# EAGLE design Tiles_Proto3_RevB (EAGLE 8.4.1)
CNAME: TIles Prototype 3; CREVISION: B; DESIGNER: Simone Mora
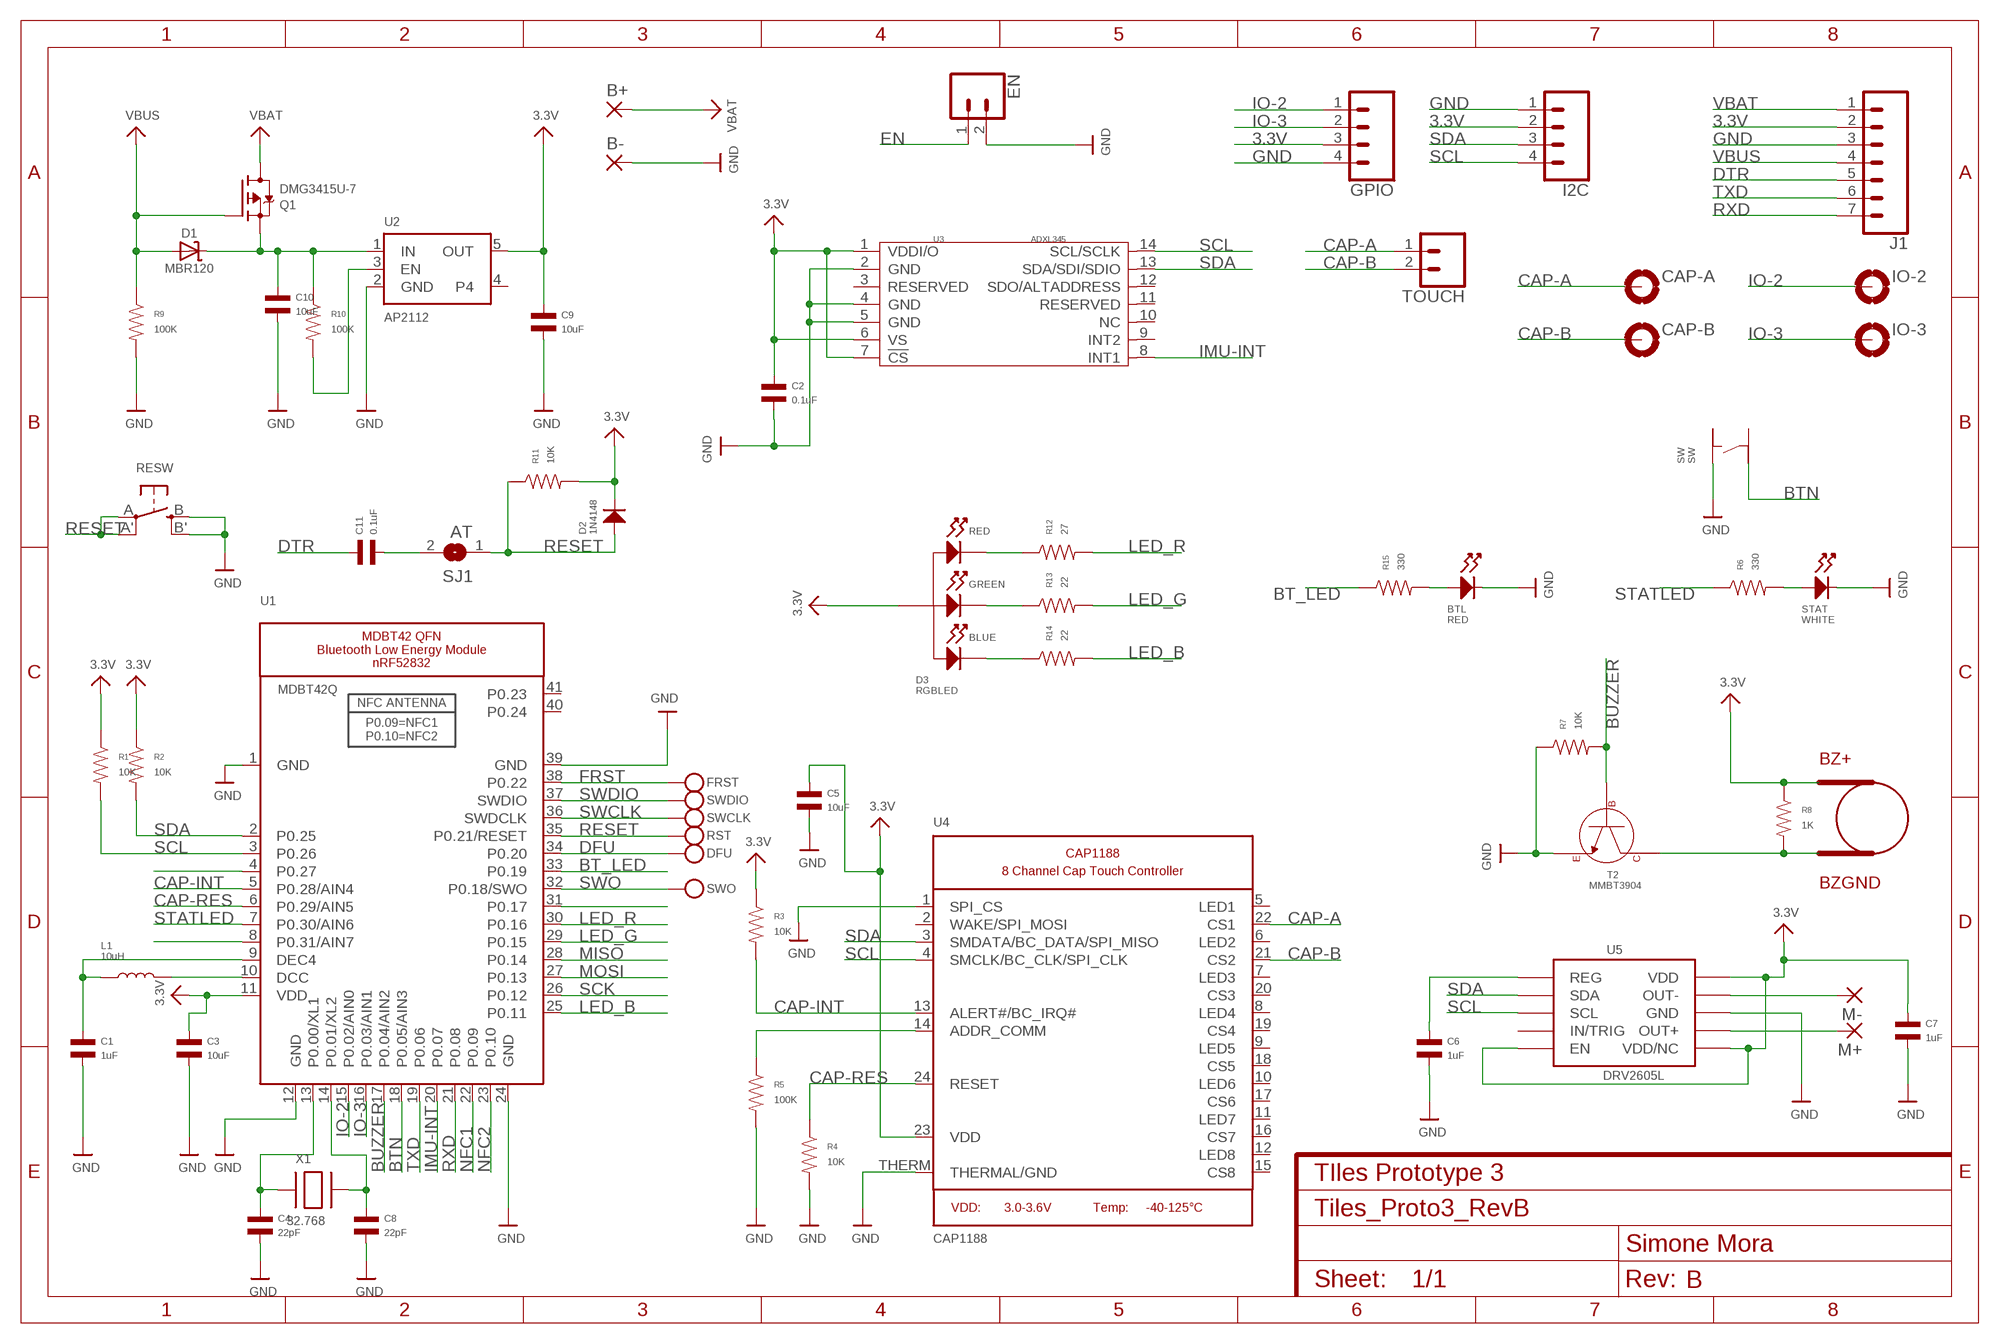
[diagram p0: schematic, sheet 1]

## Parts
B+  SMD2  [SMD1,27-2,54]
B-  SMD2  [SMD1,27-2,54]
BTL  RED  LED_SINGLE-0603-RED  [LED0603]
BUZZER  4MBUZ  [BUZPKG]
C1  1uF  CAPACITOR_NP_0603  [C0603]
C2  0.1uF  CAPACITOR_NP_0603  [C0603]
C3  10uF  CAPACITOR_NP_1206  [C1206]
C4  22pF  CAPACITOR_NP_0603  [C0603]
C5  10uF  CAPACITOR_NP_1206  [C1206]
C6  1uF  CAPACITOR_NP_0603  [C0603]
C7  1uF  CAPACITOR_NP_0603  [C0603]
C8  22pF  CAPACITOR_NP_0603  [C0603]
C9  10uF  CAPACITOR_NP_1206  [C1206]
C10  10uF  CAPACITOR_NP_1206  [C1206]
C11  0.1uF  CAPACITOR_NP_0603  [C0603]
CAP-A  MOUNT-PAD-ROUND2.5  [2,5-PAD-SIM]
CAP-B  MOUNT-PAD-ROUND2.5  [2,5-PAD-SIM]
D1  MBR120  DIODE-SCHOTTKYSOD-123  [SOD-123]
D2  1N4148  DIODES_1N4148_SOD-123  [SOD-123]
D3  RGBLED  LED_RGB_CA_PLCC4  [PLCC4]
DFU  TESTPOINTROUND2MM  [TESTPOINT_ROUND_2MM]
EN  CONN_021X02_NO_SILK  [1X02_NO_SILK]
FRST  TESTPOINT1.5X2.0MM_NOCREAM  [PAD-1.5X2.0]
GPIO  CONN_041X04_NO_SILK  [1X04_NO_SILK]
I2C  CONN_04_SIM1X04_NO_SILK  [1X04_NO_SILK_LNG]
IO-2  MOUNT-PAD-ROUND2.5  [2,5-PAD-SIM]
IO-3  MOUNT-PAD-ROUND2.5  [2,5-PAD-SIM]
J1  CONN_07  [1X07]
L1  10uH  INDUCTOR_1210  [L1210]
M+  1,6/0,8  [1,6/0,8]
M-  1,6/0,8  [1,6/0,8]
Q1  DMG3415U-7  MOSFET-P  [SOT23-R]
R1  10K  RESISTOR_0603  [R0603]
R2  10K  RESISTOR_0603  [R0603]
R3  10K  RESISTOR_0603  [R0603]
R4  10K  RESISTOR_0603  [R0603]
R5  100K  RESISTOR_0603  [R0603]
R6  330  RESISTOR_0603  [R0603]
R7  10K  RESISTOR_0603  [R0603]
R8  1K  RESISTOR_0603  [R0603]
R9  100K  RESISTOR_0603  [R0603]
R10  100K  RESISTOR_0603  [R0603]
R11  10K  RESISTOR_0603  [R0603]
R12  27  RESISTOR_0603  [R0603]
R13  22  RESISTOR_0603  [R0603]
R14  22  RESISTOR_0603  [R0603]
R15  330  RESISTOR_0603  [R0603]
RESW  SWITCH_TACT_SMT4.6X2.8  [BTN_KMR2_4.6X2.8]
RST  TESTPOINTROUND2MM  [TESTPOINT_ROUND_2MM]
SJ1  AT  SOLDERJUMPERCLOSED  [SOLDERJUMPER_CLOSEDWIRE]
STAT  WHITE  LED_SINGLE-0603-RED  [LED0603]
SW  SW  TACT_4.2MM  [TACT4.2MM]
SWCLK  TESTPOINTROUND2MM  [TESTPOINT_ROUND_2MM]
SWDIO  TESTPOINTROUND2MM  [TESTPOINT_ROUND_2MM]
SWO  TESTPOINTROUND2MM  [TESTPOINT_ROUND_2MM]
T2  MMBT3904  NPN_BJTMMBT3904_SOT-23-3  [SOT-23-3]
TOUCH  CONN_021X02_NO_SILK  [1X02_NO_SILK]
U1  MDBT42Q  NRF52832_MODULE_MDBT42  [BLE_MODULE_RAYTAC_MDBT42]
U2  AP2112  VREG_SOT23-5  [SOT23-5]
U3  ADXL345  MOTION/POSITION-ADXL345BCCZ-RL(14P-5.0X3.0MM)  [LGA14-0.8-5.0X3.0MM]
U4  CAP1188  [QFN24_4MM_SMSC]
U5  DRV2605L  [VSSOP-10]
X1  32.768  XTAL-3.2X1.5  [XTAL3215]

## Nets
3.3V: BUZZER.BZ+(BUZSIG+) C2.P$1 C3.P$1 C5.P$1 C7.P$1 C9.P$1 D2.CATHODE D3.P$1(ANODE) GPIO.3 I2C.2 J1.2 R1.P$1 R2.P$1 R3.P$1 R8.P$1 R11.P$2 U1.11(VDD) U2.5(OUT) U3.1(VDDI/O) U3.6(VS) U3.7(!CS) U4.23(VDD) U5.P$5(EN) U5.P$6(VDD/NC) U5.P$10(VDD)
BT_LED: R15.P$1 U1.33(P0.19)
BTN: SW.P$3 U1.18(P0.05/AIN3)
BUZZER: R7.P$2 T2.P$1(BASE) U1.17(P0.04/AIN2)
CAP-A: CAP-A.B2,8(MOUNT) TOUCH.1 U4.22(CS1)
CAP-B: CAP-B.B2,8(MOUNT) TOUCH.2 U4.21(CS2)
CAP-INT: R3.P$2 U1.5(P0.28/AIN4) U4.13(ALERT#/BC_IRQ#)
CAP-RES: R4.P$1 U1.6(P0.29/AIN5) U4.24(RESET)
DFU: DFU.P$1 U1.34(P0.20)
DTR: C11.P$1 J1.5
EN: EN.1 R10.P$2 U2.3(EN)
FRST: FRST.P$1 U1.38(P0.22)
GND: B-.1(P) BTL.CATHODE C1.P$2 C2.P$2 C3.P$2 C4.P$2 C5.P$2 C6.P$2 C7.P$2 C8.P$2 C9.P$2 C10.P$2 EN.2 GPIO.4 I2C.1 J1.3 R4.P$2 R5.P$2 R7.P$1 R9.P$2 RESW.B'(S1) RESW.B(S) STAT.CATHODE SW.P$1 T2.P$2(EMITTER) U1.1(GND) U1.12(GND) U1.24(GND) U1.39(GND) U2.2(GND) U3.2(GND) U3.4(GND) U3.5(GND) U4.1(SPI_CS) U4.THERM(THERMAL/GND) U5.P$8(GND)
IMU-INT: U1.20(P0.07) U3.8(INT1)
IO-2: GPIO.1 IO-2.B2,8(MOUNT) U1.15(P0.02/AIN0)
IO-3: GPIO.2 IO-3.B2,8(MOUNT) U1.16(P0.03/AIN1)
LED_B: R14.P$2 U1.25(P0.11)
LED_G: R13.P$2 U1.29(P0.15)
LED_R: R12.P$2 U1.30(P0.16)
MISO: U1.28(P0.14)
MOSI: U1.27(P0.13)
N$1: L1.P$2 U1.10(DCC)
N$2: C1.P$1 L1.P$1 U1.9(DEC4)
N$3: R5.P$1 U4.14(ADDR_COMM)
N$4: BUZZER.BZ-(BUZGND) R8.P$2 T2.P$3(COLLECTOR)
N$5: C6.P$1 U5.P$1(REG)
N$7: M-.1(P) U5.P$9(OUT-)
N$8: M+.1(P) U5.P$7(OUT+)
N$9: R6.P$2 STAT.ANODE
N$11: C4.P$1 U1.13(P0.00/XL1) X1.P$1
N$12: C8.P$1 U1.14(P0.01/XL2) X1.P$2
N$13: C10.P$1 D1.C Q1.2(S) R10.P$1 U2.1(IN)
N$14: D3.P$2(CATHODE_RED) R12.P$1
N$15: U1.4(P0.27)
N$16: D3.P$3(CATHODE_GREEN) R13.P$1
N$17: D3.P$4(CATHODE_BLUE) R14.P$1
N$18: BTL.ANODE R15.P$2
N$19: U1.8(P0.31/AIN7)
N$20: C11.P$2 SJ1.2
N$26: U1.31(P0.17)
NFC1: U1.22(P0.09)
NFC2: U1.23(P0.10)
RESET: D2.ANODE R11.P$1 RESW.A'(P1) RESW.A(P) RST.P$1 SJ1.1 U1.35(P0.21/RESET)
RXD: J1.7 U1.21(P0.08)
SCK: U1.26(P0.12)
SCL: I2C.4 R1.P$2 U1.3(P0.26) U3.14(SCL/SCLK) U4.4(SMCLK/BC_CLK/SPI_CLK) U5.P$2(SCL)
SDA: I2C.3 R2.P$2 U1.2(P0.25) U3.13(SDA/SDI/SDIO) U4.3(SMDATA/BC_DATA/SPI_MISO) U5.P$3(SDA)
STATLED: R6.P$1 U1.7(P0.30/AIN6)
SWCLK: SWCLK.P$1 U1.36(SWDCLK)
SWDIO: SWDIO.P$1 U1.37(SWDIO)
SWO: SWO.P$1 U1.32(P0.18/SWO)
TXD: J1.6 U1.19(P0.06)
VBAT: B+.1(P) J1.1 Q1.3(D)
VBUS: D1.A J1.4 Q1.1(G) R9.P$1
Unconnected: SW.P$2 SW.P$4 U1.40(P0.24) U1.41(P0.23) U2.4 U3.3(RESERVED) U3.9(INT2) U3.10(NC) U3.11(RESERVED) U3.12(SDO/ALTADDRESS) U4.2(WAKE/SPI_MOSI) U4.5(LED1) U4.6(LED2) U4.7(LED3) U4.8(LED4) U4.9(LED5) U4.10(LED6) U4.11(LED7) U4.12(LED8) U4.15(CS8) U4.16(CS7) U4.17(CS6) U4.18(CS5) U4.19(CS4) U4.20(CS3) U5.P$4(IN/TRIG)

## Library data of the parts
B+ B- = wirepad:SMD2: SMD PAD
BTL = MF_LEDs:LED_SINGLE: Library: MF_LEDs Description: Device for Single LED Packages. Manufacture part number (MFG#) can be added via Attributes.; HOUSEPART: YES; MPN: MF-LED-0603-RED; POPULATE: 1; URL: https://factory.macrofab.com/part/MF-LED-0603-RED; VALUE: MF-LED-0603-RED
BUZZER = tiles:4MBUZ; HOUSEPART: no; MPN: 490-CMT-4023S-SMT-TR; POPULATE: 1
C1 C6 C7 = MF_Passives:CAPACITOR_NP: Library: MF_Passives Description: Device for Non-Polarized Capacitors. Manufacture part number (MPN) can be added via Attributes. Check https://factory.macrofab.com/parts for the house parts list.; HOUSEPART: YES; MPN: MF-CAP-0603-1uF; POPULATE: 1
C2 C11 = MF_Passives:CAPACITOR_NP: Library: MF_Passives Description: Device for Non-Polarized Capacitors. Manufacture part number (MPN) can be added via Attributes. Check https://factory.macrofab.com/parts for the house parts list.; HOUSEPART: YES; MPN: MF-CAP-0603-0.1uF; POPULATE: 1
C3 C5 C9 C10 = MF_Passives:CAPACITOR_NP: Library: MF_Passives Description: Device for Non-Polarized Capacitors. Manufacture part number (MPN) can be added via Attributes. Check https://factory.macrofab.com/parts for the house parts list.; HOUSEPART: YES; MPN: MF-CAP-1206-10uF; POPULATE: 1
C4 C8 = MF_Passives:CAPACITOR_NP: Library: MF_Passives Description: Device for Non-Polarized Capacitors. Manufacture part number (MPN) can be added via Attributes. Check https://factory.macrofab.com/parts for the house parts list.; HOUSEPART: YES; MPN: MF-CAP-0603-22pF; POPULATE: 1
CAP-A CAP-B IO-2 IO-3 = tiles:MOUNT-PAD-ROUND: MOUNTING PAD, round; POPULATE: 0
D1 = microbuilder2:DIODE-SCHOTTKY; HOUSEPART: NO; MPN: MBR120LSFT1G; POPULATE: 1
D2 = MF_Discrete_Semiconductor:DIODES: Library: MF_Discrete_Semiconductor Description: Device for Single Packaged Diodes.; HOUSEPART: YES; MPN: MF-DIO-SOD123-1N4148; POPULATE: 1; URL: https://factory.macrofab.com/part/MF-DIO-SOD123-1N4148; VALUE: MF-DIO-SOD123-1N4148
D3 = MF_LEDs:LED_RGB_CA: Library: MF_LEDs Description: Device for RGB LED Packages with Common Anodes. Manufacture part number (MFG#) can be added via Attributes.; HOUSEPART: YES; MPN: MF-LED-3228-RGB; POPULATE: 1; URL: https://factory.macrofab.com/part/MF-LED-3228-RGB; VALUE: MF-LED-3228-RGB
DFU FRST RST SWCLK SWDIO SWO = microbuilder2:TESTPOINT: Test Point Various test points for characterisation and PCB testing TESTPOINT_SMT - Compact Surface Mount Test Point [Digikey: 5016KTR-ND]; POPULATE: 0
EN TOUCH = SparkFun-Connectors:CONN_02: Multi connection point. Often used as Generic Header-pin footprint for 0.1 inch spaced/style header connections On any of the 0.1 inch spaced packages, you can populate with these: Break Away Headers - Straight <https://www.sparkfun.com/products/116> (PRT-00116) Break Away Male Headers - Right Angle <https://www.sparkfun.com/products/553> (PRT-00553) Female Headers <https://www.sparkfun.com/products/115> (PRT-00115) Break Away Headers - Machine Pin <https://www.sparkfun.com/products/117> (PRT-00117) Break Away Female Headers - Swiss Machine Pin <https://www.sparkfun.com/products/743> (PRT-00743) For SCREWTERMINALS and SPRING TERMINALS visit here: Screw Terimnals on SparkFun.com <https://www.sparkfun.com/search/results?term=Screw+Terminals> (5mm/3.5mm/2.54mm spacing) This device is also useful as a general connection point to wire up your design to another part of your project. Our various solder wires solder well into these plated through hole pads. Hook-Up Wire - Assortment (Stranded, 22 AWG) <https://www.sparkfun.com/products/11375> (PRT-11375) Hook-Up Wire - Assortment (Solid Core, 22 AWG) <https://www.sparkfun.com/products/11367> (PRT-11367) View the entire wire category on our website here <https://www.sparkfun.com/categories/141> Special notes: Molex polarized connector foot print use with: PRT-08233 with associated crimp pins and housings. 2.54_SCREWTERM for use with PRT-10571. 3.5mm Screw Terminal footprints for PRT-08084 5mm Screw Terminal footprints for use with PRT-08432; POPULATE: 0
GPIO = SparkFun-Connectors:CONN_04: Multi connection point. Often used as Generic Header-pin footprint for 0.1 inch spaced/style header connections On any of the 0.1 inch spaced packages, you can populate with these: Break Away Headers - Straight <https://www.sparkfun.com/products/116> (PRT-00116) Break Away Male Headers - Right Angle <https://www.sparkfun.com/products/553> (PRT-00553) Female Headers <https://www.sparkfun.com/products/115> (PRT-00115) Break Away Headers - Machine Pin <https://www.sparkfun.com/products/117> (PRT-00117) Break Away Female Headers - Swiss Machine Pin <https://www.sparkfun.com/products/743> (PRT-00743) For SCREWTERMINALS and SPRING TERMINALS visit here: Screw Terimnals on SparkFun.com <https://www.sparkfun.com/search/results?term=Screw+Terminals> (5mm/3.5mm/2.54mm spacing) This device is also useful as a general connection point to wire up your design to another part of your project. Our various solder wires solder well into these plated through hole pads. Hook-Up Wire - Assortment (Stranded, 22 AWG) <https://www.sparkfun.com/products/11375> (PRT-11375) Hook-Up Wire - Assortment (Solid Core, 22 AWG) <https://www.sparkfun.com/products/11367> (PRT-11367) View the entire wire category on our website here <https://www.sparkfun.com/categories/141> Special notes: Molex polarized connector foot print use with SKU : PRT-08231 with associated crimp pins and housings. 1MM SMD Version SKU: PRT-10208; POPULATE: 0; PROD_ID: CONN-09696
I2C = tiles:CONN_04_SIM: Multi connection point. Often used as Generic Header-pin footprint for 0.1 inch spaced/style header connections On any of the 0.1 inch spaced packages, you can populate with these: Break Away Headers - Straight <https://www.sparkfun.com/products/116> (PRT-00116) Break Away Male Headers - Right Angle <https://www.sparkfun.com/products/553> (PRT-00553) Female Headers <https://www.sparkfun.com/products/115> (PRT-00115) Break Away Headers - Machine Pin <https://www.sparkfun.com/products/117> (PRT-00117) Break Away Female Headers - Swiss Machine Pin <https://www.sparkfun.com/products/743> (PRT-00743) For SCREWTERMINALS and SPRING TERMINALS visit here: Screw Terimnals on SparkFun.com <https://www.sparkfun.com/search/results?term=Screw+Terminals> (5mm/3.5mm/2.54mm spacing) This device is also useful as a general connection point to wire up your design to another part of your project. Our various solder wires solder well into these plated through hole pads. Hook-Up Wire - Assortment (Stranded, 22 AWG) <https://www.sparkfun.com/products/11375> (PRT-11375) Hook-Up Wire - Assortment (Solid Core, 22 AWG) <https://www.sparkfun.com/products/11367> (PRT-11367) View the entire wire category on our website here <https://www.sparkfun.com/categories/141> Special notes: Molex polarized connector foot print use with SKU : PRT-08231 with associated crimp pins and housings. 1MM SMD Version SKU: PRT-10208; POPULATE: 0; PROD_ID: CONN-09696
J1 = SparkFun-Connectors:CONN_07: Multi connection point. Often used as Generic Header-pin footprint for 0.1 inch spaced/style header connections On any of the 0.1 inch spaced packages, you can populate with these: Break Away Headers - Straight <https://www.sparkfun.com/products/116> (PRT-00116) Break Away Male Headers - Right Angle <https://www.sparkfun.com/products/553> (PRT-00553) Female Headers <https://www.sparkfun.com/products/115> (PRT-00115) Break Away Headers - Machine Pin <https://www.sparkfun.com/products/117> (PRT-00117) Break Away Female Headers - Swiss Machine Pin <https://www.sparkfun.com/products/743> (PRT-00743) For SCREWTERMINALS and SPRING TERMINALS visit here: Screw Terimnals on SparkFun.com <https://www.sparkfun.com/search/results?term=Screw+Terminals> (5mm/3.5mm/2.54mm spacing) This device is also useful as a general connection point to wire up your design to another part of your project. Our various solder wires solder well into these plated through hole pads. Hook-Up Wire - Assortment (Stranded, 22 AWG) <https://www.sparkfun.com/products/11375> (PRT-11375) Hook-Up Wire - Assortment (Solid Core, 22 AWG) <https://www.sparkfun.com/products/11367> (PRT-11367) View the entire wire category on our website here <https://www.sparkfun.com/categories/141> Special notes: Molex polarized connector foot print use with SKU : PRT-08231 with associated crimp pins and housings. 1MM SMD Version SKU: PRT-10208 NOTES ON THE VARIANTS LOCK and LOCK_LONGPADS... This footprint was designed to help hold the alignment of a through-hole component (i.e. 6-pin header) while soldering it into place. You may notice that each hole has been shifted either up or down by 0.005 of an inch from it's more standard position (which is a perfectly straight line). This slight alteration caused the pins (the squares in the middle) to touch the edges of the holes. Because they are alternating, it causes a "brace" to hold the component in place. 0.005 has proven to be the perfect amount of "off-center" position when using our standard breakaway headers. Although looks a little odd when you look at the bare footprint, once you have a header in there, the alteration is very hard to notice. Also,if you push a header all the way into place, it is covered up entirely on the bottom side.
L1 = MF_Passives:INDUCTOR: Library: MF_Passives Description: Device for Inductors. Manufacture part number (MPN) can be added via Attributes. Check https://factory.macrofab.com/parts for the house parts list.; HOUSEPART: YES; MPN: MF-IND-1210-10uH; POPULATE: 1
M+ M- = wirepad:1,6/0,8: THROUGH-HOLE PAD
Q1 = microbuilder2:MOSFET-P: P-Channel Mosfet LEGEND VDS: Voltage Drain-Source ID: Drain Current RDS(ON): Drain-Source On-State Resistance VGS(TH): Gate-Source Threshold Voltage CISS: Drain-Source Input Capacitance SOT-23 Name VDS ID RDS(ON) VGS(TH) CISS Order Number IRLML5103 30V 760mA 600 mOhm -- 75pF @ 25V Digikey: IRLML5103PBFCT-ND IRLML6401 12V 4.3A 50 mOhm 950mV @ 250µA 830pF @ 10V Digikey: IRLML6401PBFTR-ND NTR0202PL 20V 400mA 800 mOhm 2.3V @ 250uA 70pF @ 5V Digikey: NTR0202PLT1GOSTR-ND NTR4101PT1G 20V 1.8A 85 mOhm 1.2V @ 250uA 675pF @ 10V Digikey: NTR4101PT1GOSCT-ND DMP2004K 20V 600mA 900 mOhm 1V @ 250uA 175pF @ 16V Digikey: DMP2004KDICT-ND PMV65XP 20V 3.9A 76 mOhm 950mV @ 1mA 725pF @ 20V Digikey: 568-2358-2-ND TO-252 Name VDS ID RDS(ON) VGS(TH) CISS Order Number AOD417 30V 25A 34 mOhm 3V @ 250µA 920pF @ 15V Digikey: 785-1106-2-ND; HOUSEPART: YES; MPN: MF-DSC-SOT233-BSS84; POPULATE: 1
R1-R4 R7 R11 = MF_Passives:RESISTOR: Library: MF_Passives Description: Device for Resistors. Manufacture part number (MPN), Voltage, Tolerance, and Wattage Rating can be added via Attributes. Check https://factory.macrofab.com/parts for the house parts list.; HOUSEPART: YES; MPN: MF-RES-0603-10K; POPULATE: 1
R5 R9 R10 = MF_Passives:RESISTOR: Library: MF_Passives Description: Device for Resistors. Manufacture part number (MPN), Voltage, Tolerance, and Wattage Rating can be added via Attributes. Check https://factory.macrofab.com/parts for the house parts list.; HOUSEPART: YES; MPN: MF-RES-0603-100K; POPULATE: 1
R6 R15 = MF_Passives:RESISTOR: Library: MF_Passives Description: Device for Resistors. Manufacture part number (MPN), Voltage, Tolerance, and Wattage Rating can be added via Attributes. Check https://factory.macrofab.com/parts for the house parts list.; HOUSEPART: YES; MPN: MF-RES-0603-330; POPULATE: 1
R8 = MF_Passives:RESISTOR: Library: MF_Passives Description: Device for Resistors. Manufacture part number (MPN), Voltage, Tolerance, and Wattage Rating can be added via Attributes. Check https://factory.macrofab.com/parts for the house parts list.; HOUSEPART: YES; MPN: MF-RES-0603-1K; POPULATE: 1
R12 = MF_Passives:RESISTOR: Library: MF_Passives Description: Device for Resistors. Manufacture part number (MPN), Voltage, Tolerance, and Wattage Rating can be added via Attributes. Check https://factory.macrofab.com/parts for the house parts list.; HOUSEPART: YES; MPN: MF-RES-0603-27; POPULATE: 1
R13 R14 = MF_Passives:RESISTOR: Library: MF_Passives Description: Device for Resistors. Manufacture part number (MPN), Voltage, Tolerance, and Wattage Rating can be added via Attributes. Check https://factory.macrofab.com/parts for the house parts list.; HOUSEPART: YES; MPN: MF-RES-0603-22; POPULATE: 1
RESW = microbuilder2:SWITCH_TACT_SMT: SMT Tact Switches 6x6mm - Digikey: P12940SCT-ND KMR2 (4.6x2.8mm) - Digikey: 401-1426-1-ND EVQ-PQHB55 - Light Touch, 160GF (4.5x4.5mm) - Digikey: P8090SCT-ND KMT0 - KMT021 NGJ LHS (etc.) IP68/Waterproof - Digikey: CKN10289CT-ND; POPULATE: 0
SJ1 = microbuilder2:SOLDERJUMPER: SMD Solder JUMPER Solder the two pads together to create a connection, or remove the solder to break it. REFLOW - Use this footprint for solder paste and reflow ovens. WAVE - Use this footprint for hand-soldering (larger pads). CLOSED - Has a trace between the two pads to ensure it is closed by default. The trace needs to be cut to disable the jumper, and can be closed again by creating a solder bridge between the two pads.
STAT = MF_LEDs:LED_SINGLE: Library: MF_LEDs Description: Device for Single LED Packages. Manufacture part number (MFG#) can be added via Attributes.; HOUSEPART: NO; MPN: LNJ037X8ARA; POPULATE: 1; URL: https://factory.macrofab.com/part/MF-LED-0603-RED; VALUE: MF-LED-0603-RED
SW = MF_Switches:TACT: Library: MF_Switches Description: Device for Tact Switches. Manufacture part number (MFG#) can be added via Attributes.; HOUSEPART: YES; MPN: MF-SW-TACT-4.2MM; POPULATE: 1; URL: https://factory.macrofab.com/part/MF-SW-TACT-4.2MM; VALUE: MF-SW-TACT-4.2MM
T2 = MF_Discrete_Semiconductor:NPN_BJT: Library: MF_Discrete_Semiconductor Description: Device for Single NPN BJT Transistors. Manufacture part number (MFG#) can be added via Attributes.; HOUSEPART: YES; MPN: MF-DSC-SOT233-MMBT3904; POPULATE: 1; URL: https://factory.macrofab.com/part/MF-DSC-SOT233-MMBT3904; VALUE: MF-DSC-SOT233-MMBT3904
U1 = microbuilder2:NRF52832_MODULE_MDBT42: MDBT42 - BLE Module (nRF52832 QFN) VDD: 1.7-3.6V; HOUSEPART: NO; MPN: 317030213; POPULATE: 1
U2 = microbuilder2:VREG_SOT23-5: SOT23-5 Fixed Voltage Regulators Part Current Out V Out V In V Dropout θJA (°C/W) TJ (°C) Digikey Part No. ADP121 150mA 3.3V 3.4-5.5V 0.09V @ 150mA -- -- ADP121-AUJZ33R7CT-ND ADP121 150mA 3.0V 3.1-5.5V 0.09V @ 150mA -- -- ADP121-AUJZ30R7CT-ND ADP122 300mA 3.3V 3.4-5.5V 0.085V @ 300mA -- -- ADP122AUJZ-3.3-R7CT-ND ADP1712 300mA 3.3V 3.5-5.5V 0.17V @ 300mA -- -- ADP1712AUJZ-3.3-R7TR-ND AP7311 (Low Cost) 150mA 3.3V 3.5-6V 0.15V @ 150mA -- -- AP7311-33WG-7DICT-ND LD39015M18R 150mA 1.8V 1.9V-5.5V 0.08V @ 100mA -- -- 497-6977-1-ND LP2985A-33DBVR 150mA 3.3V 3.3-16V 0.28V @ 150mA 206 150 296-18479-1-ND MCP1824T-3302E/OT 300mA 3.3V 3.5V-6V 0.2V @ 300mA -- -- MCP1824T-3302E/OTCT-ND MIC5205-2.5YM5 TR 150mA 2.5V 2.7-16V 0.165V @ 150mA -- -- 576-1257-2-ND MIC5205-3.0YM5 TR 150mA 3.0V 3.2V-16V 0.165V @ 150mA -- -- 576-1258-2-ND MIC5205-3.3YM5 TR 150mA 3.3V 3.5V-16V 0.165V @ 150mA -- -- 576-1259-2-ND TPS780330220 150mA 3.3V+2.2V 3.6-5.5V 250mV Max -- -- 296-23332-1-ND TDA3663/N1,135 100mA 3.3V 3.5-45V 0.18V @ 50mA -- -- 568-5343-1-ND Max operating temp can be calculated using θJA, TJ (max junction temperature), and power in watts. Set the "Maximum Ambient Temperature" until it reaches TJ ("Max Junction Temperature"), which is the absolute limit for safe use of the regulator: Heat Sink Temperature Calculator <http://www.daycounter.com/Calculators/Heat-Sink-Temperature-Calculator.phtml> For example, With 12V source into a 3.3V LP2985 and a 30mA load, we are dissipating (12V-3.3V) * 0.03A = 0.261W. With a θJA of 206 °C/W, a TJ of 150°C, and 261mW we can safely use the chip without a heat sink up to 75°C (=147.1°C Junction Temperature).; HOUSEPART: NO; MPN: AP2112K-3.3TRG1; POPULATE: 1
U3 = Seeed-OPL-sensor:MOTION/POSITION-ADXL345BCCZ-RL(14P-5.0X3.0MM): 314080008; HOUSEPART: no; MPN: ADXL345BCCZ-RL; POPULATE: 1; VALUE: ADXL345BCCZ-RL
U4 = cap1188-microbuilder:CAP1188: CAP1188 - Eight Channel Cap Touch Controller; HOUSEPART: NO; MPN: CAP1188-1-CP-TR; POPULATE: 1
U5 = SparkFun-IC-Special-Function:DRV2605L; HOUSEPART: NO; MPN: DRV2605LDGST; POPULATE: 1; PROD_ID: IC-13504
X1 = adafruit2:XTAL: Low cost SMT crystals, no capacitors included http://www.ladyada.net/library/eagle; HOUSEPART: no; MPN: ABS07-120-32.768KHZ-T; POPULATE: 1

## Board
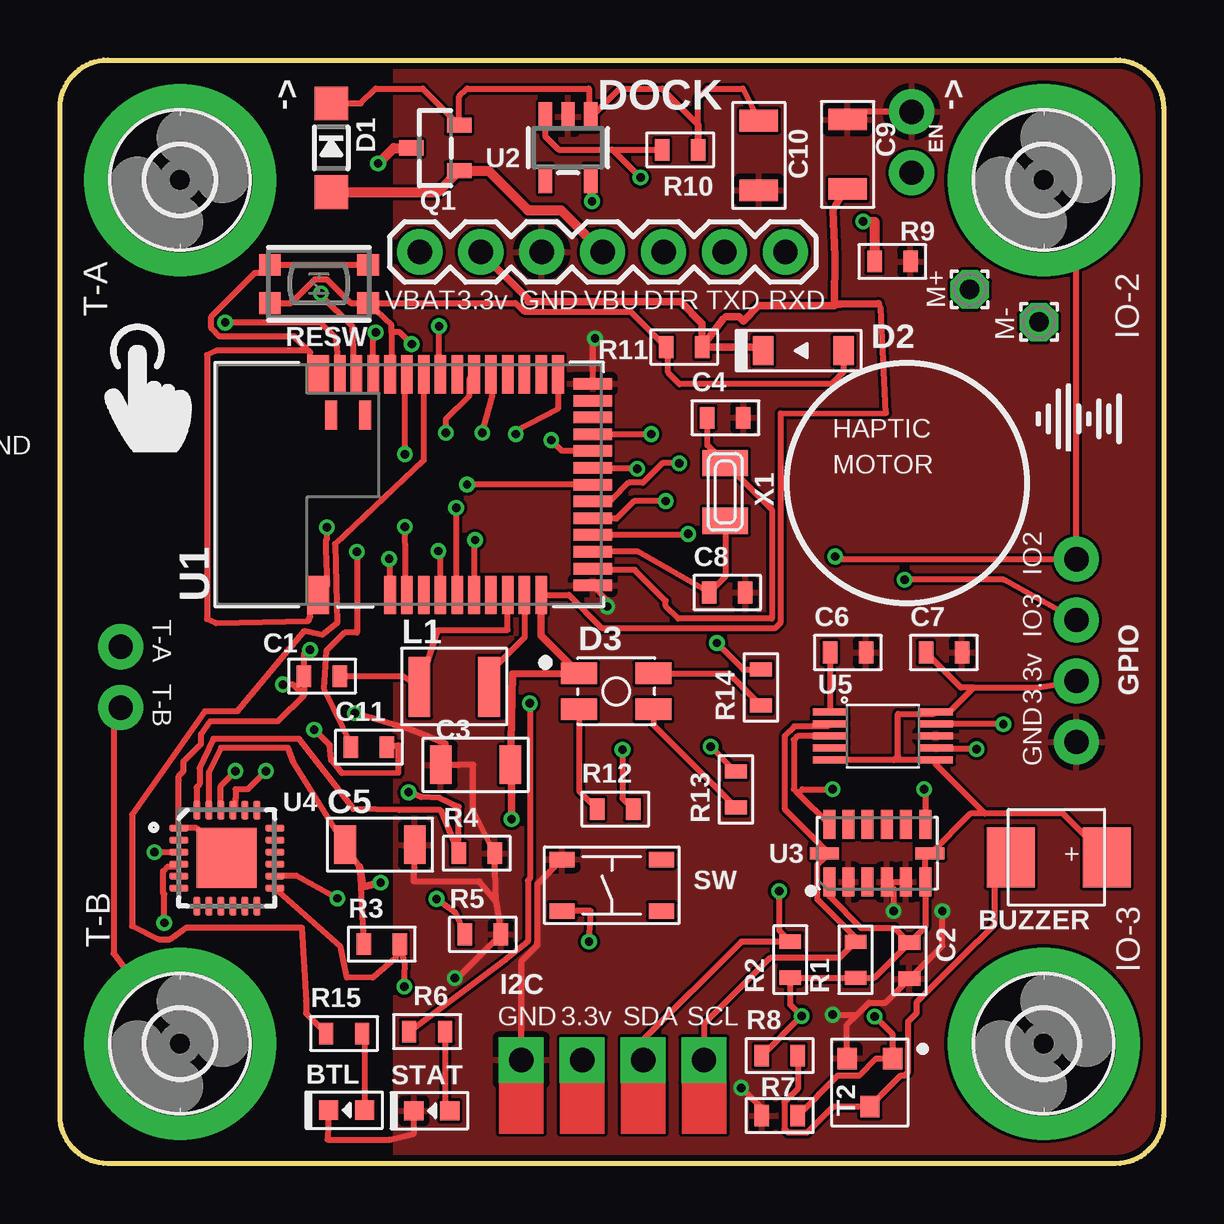
[diagram p1: board, top side]
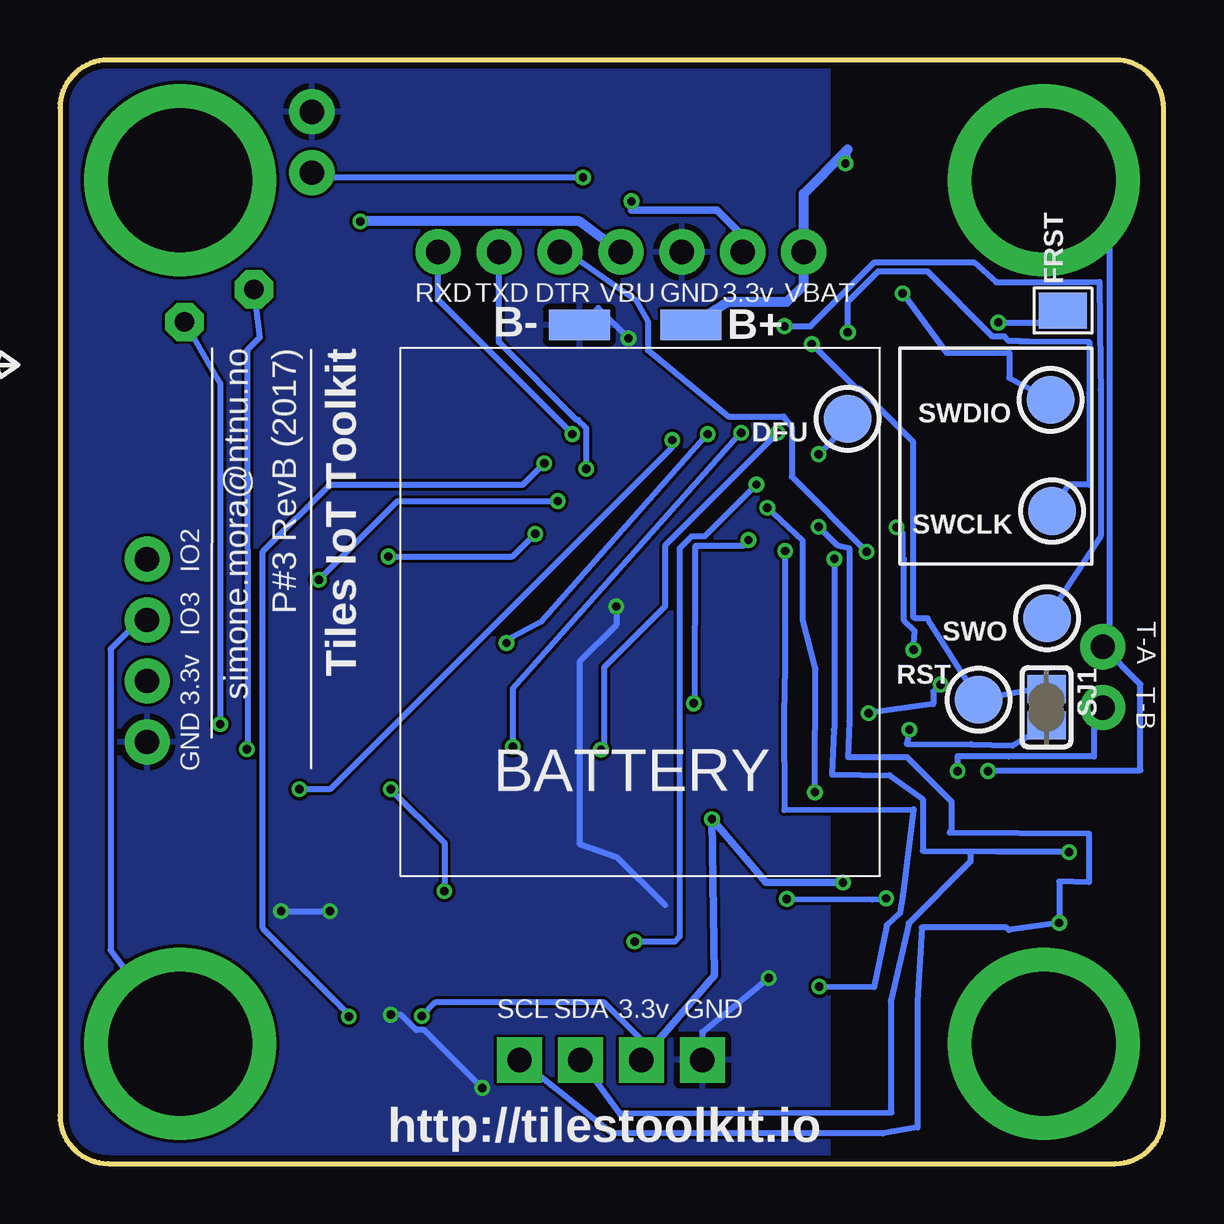
[diagram p2: board, bottom side, seen from below]

Size 46 x 46 mm. Coordinates in mm from the lower left corner, seen from the top.
Outline: 44,0 2,0 arc-90 0,2 0,44 arc-90 2,46 44,46 arc-90 46,44 46,2 arc-90 44,0
Copper layers (1*16): Top 0.035mm / dielectric 1.5mm / Bottom 0.035mm
Design rules "MF_Standard_2_Layer": minimum track width 5mil, minimum drill 12mil, track to track 5mil, track to pad 5mil, pad to pad 5mil, via to via 5mil, smd to smd 0mil, copper to edge 10mil, drill to drill 10mil, minimum pad ring 6mil, minimum via ring 6mil, stop-mask expansion 2mil, vias tented up to drill 25mil, thermal gap 10mil

### Footprints (pad centres in the part's own frame; a part is rotated, then mirrored left to right if it is on the bottom)
SMD1,27-2,54 = smd 1.27 x 2.54: 1 0,0
LED0603 = smd 0.8 x 0.8: ANODE 0.75,0; CATHODE -0.75,0
BUZPKG = smd 2 x 2.5: BZ+ 1.863,0.222; BZ- -2.137,0.222
C0603 = smd 0.6 x 0.9: P$1 -0.75,0; P$2 0.75,0
C1206 = smd 0.9 x 1.6: P$1 -1.45,0; P$2 1.45,0
2,5-PAD-SIM = drill 6 pad 8: B2,8 0,0
SOD-123 = smd 1.4 x 1.4: A 1.85,0; C -1.85,0
SOD-123' = smd 0.85 x 1.2: ANODE 1.675,0; CATHODE -1.675,0
PLCC4 = smd 1.5 x 0.9: P$1 -1.55,0.75; P$2 -1.55,-0.75; P$3 1.55,-0.75; P$4 1.55,0.75
TESTPOINT_ROUND_2MM = smd 2 x 2: P$1 0,0
1X02_NO_SILK = drill 1.016 pad 1.88: 1 0,0; 2 2.54,0
PAD-1.5X2.0 = smd 1.5 x 2: P$1 0,0
1X04_NO_SILK = drill 1.016 pad 1.88: 1 0,0; 2 2.54,0; 3 5.08,0; 4 7.62,0
1X04_NO_SILK_LNG = drill 1.016 pad 1.88 square: 1 0,0; 2 2.54,0; 3 5.08,0; 4 7.62,0
1X07 = drill 1.016 pad 1.88: 1 0,0; 2 2.54,0; 3 5.08,0; 4 7.62,0; 5 10.16,0; 6 12.7,0; 7 15.24,0
L1210 = smd 0.9 x 2.5: P$1 -1.45,0; P$2 1.45,0
1,6/0,8 = drill 0.813 pad 1.6 octagon: 1 0,0
SOT23-R = smd 0.635 x 1.016: 1 -0.95,-1; 2 0.95,-1; 3 0,1
R0603 = smd 0.6 x 0.9: P$1 -0.75,0; P$2 0.75,0
BTN_KMR2_4.6X2.8 = smd 0.9 x 0.9: A 2.05,0.8; A' -2.05,0.8; B 2.05,-0.8; B' -2.05,-0.8
SOLDERJUMPER_CLOSEDWIRE = smd 1.168 x 1.6: 1 -0.762,0; 2 0.762,0 | smd 0.635 x 0.203: WIRE 0,0
TACT4.2MM = smd 1.05 x 0.65: P$1 -2.075,1.075; P$2 2.075,1.075; P$3 -2.075,-1.075; P$4 2.075,-1.075
SOT-23-3 = smd 0.9 x 0.8: P$1 -1,0.95; P$2 -1,-0.95; P$3 1,0
BLE_MODULE_RAYTAC_MDBT42 = smd 1.6 x 0.9: 1 -4.6,3.8; 39 4.6,3.8 | smd 1.6 x 0.48: 2 -4.6,0.8; 3 -4.6,0.1; 4 -4.6,-0.6; 5 -4.6,-1.3; 6 -4.6,-2; 7 -4.6,-2.7; 8 -4.6,-3.4; 9 -4.6,-4.1; 10 -4.6,-4.8; 11 -4.6,-5.5; 25 4.6,-6.2; 26 4.6,-5.5; 27 4.6,-4.8; 28 4.6,-4.1; 29 4.6,-3.4; 30 4.6,-2.7; 31 4.6,-2; 32 4.6,-1.3; 33 4.6,-0.6; 34 4.6,0.1; 35 4.6,0.8; 36 4.6,1.5; 37 4.6,2.2; 38 4.6,2.9 | smd 0.48 x 1.6: 12 -4.2,-7.65; 13 -3.5,-7.65; 14 -2.8,-7.65; 15 -2.1,-7.65; 16 -1.4,-7.65; 17 -0.7,-7.65; 18 0,-7.65; 19 0.7,-7.65; 20 1.4,-7.65; 21 2.1,-7.65; 22 2.8,-7.65; 23 3.5,-7.65; 24 4.2,-7.65 | smd 1.2 x 0.5: 40 2.9,3.25; 41 2.9,1.85
SOT23-5 = smd 0.55 x 1.2: 1 -0.95,-1.3; 2 0,-1.3; 3 0.95,-1.3; 4 0.95,1.3; 5 -0.95,1.3
LGA14-0.8-5.0X3.0MM = smd 1.2 x 0.5: 1 -1.2,2; 2 -1.2,1.2; 3 -1.2,0.4; 4 -1.2,-0.4; 5 -1.2,-1.2; 6 -1.2,-2; 8 1.2,-2; 9 1.2,-1.2; 10 1.2,-0.4; 11 1.2,0.4; 12 1.2,1.2; 13 1.2,2 | smd 0.5 x 1.2: 7 0,-2.2; 14 0,2.2
QFN24_4MM_SMSC = smd 0.8 x 0.28: 1 -2,1.25; 2 -2,0.75; 3 -2,0.25; 4 -2,-0.25; 5 -2,-0.75; 6 -2,-1.25; 13 2,-1.25; 14 2,-0.75; 15 2,-0.25; 16 2,0.25; 17 2,0.75; 18 2,1.25 | smd 0.28 x 0.8: 7 -1.25,-2; 8 -0.75,-2; 9 -0.25,-2; 10 0.25,-2; 11 0.75,-2; 12 1.25,-2; 19 1.25,2; 20 0.75,2; 21 0.25,2; 22 -0.25,2; 23 -0.75,2; 24 -1.25,2 | smd 2.5 x 2.5: THERM 0,0
VSSOP-10 = smd 1.45 x 0.3: P$1 -1.905,1.06; P$2 -1.905,0.56; P$3 -1.905,0.06; P$4 -1.905,-0.44; P$5 -1.905,-0.94; P$6 2.495,-0.94; P$7 2.495,-0.44; P$8 2.495,0.06; P$9 2.495,0.56; P$10 2.495,1.06
XTAL3215 = smd 1.1 x 1.9: P$1 1.2,0; P$2 -1.2,0

### Placement (x,y rotation side)
B+  19.7,34.96 270 bottom
B-  24.35,34.96 270 bottom
BTL  11.94,2.23 0 top
BUZZER  41.77,12.54 0 top
C1  10.92,20.32 180 top
C2  35.41,8.45 270 top
C3  17.32,16.62 180 top
C4  27.74,31.09 0 top
C5  13.34,13.29 0 top
C6  32.85,21.3 0 top
C7  36.85,21.3 0 top
C8  27.82,23.8 0 top
C9  32.83,42.07 90 top
C10  29.13,42.02 270 top
C11  12.88,17.35 0 top
CAP-A  5,41 0 top
CAP-B  5,5 0 top
D1  11.31,42.34 270 top
D2  1N4148  [SOD-123']  30.99,33.88 0 top
D3  23.19,19.68 0 top
DFU  13.17,31.04 180 bottom
EN  35.5,41.3 90 top
FRST  4.19,35.56 90 bottom
GPIO  42.37,25.2 270 top
I2C  19.23,4.31 0 top
IO-2  41,41 0 top
IO-3  41,5 0 top
J1  15,38 0 top
L1  16.44,19.87 0 top
M+  37.92,36.43 90 top
M-  40.81,35.07 90 top
Q1  15.64,42.33 90 top
R1  33.16,8.49 90 top
R2  30.44,8.5 90 top
R3  13.41,9.15 0 top
R4  17.37,12.93 0 top
R5  17.63,9.55 0 top
R6  15.3,5.5 0 top
R7  30,2 0 top
R8  30,4.5 0 top
R9  34.7,37.6 0 top
R10  25.85,42.26 180 top
R11  26.02,34.03 0 top
R12  23.14,14.78 0 top
R13  28.18,15.59 90 top
R14  29.22,19.84 90 top
R15  11.84,5.42 0 top
RESW  10.79,36.67 180 top
RST  7.7,19.34 180 bottom
SJ1  4.88,19.02 270 bottom
STAT  15.5,2.2 0 top
SW  23,11.6 0 top
SWCLK  4.64,27.2 180 bottom
SWDIO  4.7,31.83 180 bottom
SWO  4.86,22.74 180 bottom
T2  33.76,3.38 270 top
TOUCH  2.53,21.54 270 top
U1  14.56,28.3 90 top
U2  21.18,42.34 180 top
U3  34.06,12.93 90 top
U4  6.96,12.73 0 top
U5  34.01,17.76 0 top
X1  27.73,28 90 top

### Tracks (layer width: path | path; a pad name or v marks a point on that pad's centre or on a via)
3.3V  (via drill 0.35)
  Top 0.254: U4.23 6.2,16.31 6.71,17.33 9.5,17.33 9.73,16.73 C5.P$1 12.48,12.37 R3.P$1 | R8.P$1 29.26,4.5 v30.91,6.15 30.44,6.62 R2.P$1 30.45,7.74 R1.P$1 33.95,7.74 C2.P$1 | C2.P$1 36.06,9.86 U3.6 36.06,12.73 U3.7 36.3,12.93 37.95,14.58 38.56,14.58 | C2.P$1 34.8,9.81 33.4,9.81 32.06,11.15 U3.1 | BUZZER.BZ+ 41.81,14.58 38.56,14.58 | 38.56,14.58 36.5,16.64 U5.P$6 34.75,16.82 | 34.75,16.82 U5.P$5 | 34.75,16.82 34.93,17 34.93,18.75 36.44,18.75 U5.P$10 37.08,18.82 38.1,19.84 | 38.1,19.84 40.75,19.84 GPIO.3 | 38.1,19.84 37.56,19.84 C7.P$1 | U1.11 21.21,23.7 22.58,22.33 29.83,22.33 30.05,22.55 30.05,31.27 34.44,31.29 34.21,35.65 34.11,35.85 | 32.31,35.98 32.28,35.75 32.27,35.76
  Top 0.305: U2.5 22.13,40.11 v22.18,40.11 | J1.2 19.51,36.03 19.51,35.92 25.86,35.92 26.77,35.01 R11.P$2 | R11.P$2 27.64,35.19 27.75,35.31 28.3,35.31 28.48,35.12 29.11,35.75 32.28,35.75 | 32.27,35.76 32.27,35.83 | 32.27,35.83 32.31,37.83 32.21,39.73 32.88,40.91 C9.P$1 | U1.11 20.06,22.01 D3.P$1 18.87,20.41 C3.P$1 18.83,16.8 v18.82,14.36 | v13.36,11.71 12.64,11.54 12.48,12.37 | 32.27,35.83 32.53,35.83 34.11,35.85 | R11.P$2 29.17,34.03 D2.CATHODE
  Bottom 0.254: I2C.2 21.77,5.16 23.32,6.71 30.36,6.71 v30.91,6.15
  Bottom 0.305: v22.18,40.11 22.18,39.73 18.62,39.73 17.54,38.65 J1.2 | I2C.2 18.72,7.84 v18.82,14.36 16.56,11.71 v13.36,11.71
BT_LED
  Top 0.254: U1.33 15.16,32.69 15.16,29.31 11.46,25.82 11.56,22.53 10.93,22.03 10.17,22.19 7.39,18.85 6.04,18.85 3,14.55 3,9.9 4.11,9.35 4.59,9.35 5.27,9.84 10.07,9.84 10.25,6.76 10.25,6.26 R15.P$1
BTN  (via drill 0.35)
  Top 0.254: U1.18 v16.97,28.3 | v22.05,9.25 22.12,10.52 SW.P$3
  Bottom 0.254: v16.97,28.3 19.13,26.14 19.67,26.14 20.17,25.64 20.17,9.45 20.37,9.25 v22.05,9.25
BUZZER  (via drill 0.35)
  Top 0.254: R7.P$2 32.43,3.68 33.31,3.68 34.02,4.38 T2.P$1 34.71,5.38 v33.96,6.13 | v25.81,29.19 25.11,29.19 24.3,28.38 23.7,28.38 22.99,27.66 22.27,27.66 U1.17
  Bottom 0.254: v33.96,6.13 33.96,6.23 37.54,9.81 37.54,25.51 34.75,28.3 26.7,28.3 v25.81,29.19
CAP-A  (via drill 0.35)
  Top 0.254: U4.22 6.71,15.75 v7.32,16.36
  Bottom 0.254: v7.32,16.36 7.32,16.39 0.97,16.39 0.97,19.98 TOUCH.1 2.24,21.84 2.24,38.24 CAP-A.B2,8
CAP-B  (via drill 0.35)
  Top 0.254: v8.59,16.36 7.83,15.6 7.32,15.6 7.32,15.2 7.31,15.2 7.31,14.84 U4.21 | TOUCH.2 2.24,18.71 2.24,8.74 2.26,8.74 CAP-B.B2,8
  Bottom 0.254: TOUCH.2 2.9,19 2.9,16.97 6.45,16.97 8.59,16.97 v8.59,16.36
CAP-INT  (via drill 0.35)
  Top 0.254: U4.13 11.69,9.05 11.84,8.33 11.96,7.75 13.04,7.76 13.97,8.56 R3.P$2 14.38,8.32 v14.35,7.37 | U1.5 15.86,25.45 v15.78,25.53
  Bottom 0.254: v15.78,25.53 15.78,20.75 15.81,18.73 15.8,14.74 10.42,14.76 10.87,11.2 10.99,10.45 11.53,9.94 12.07,7.34 v14.35,7.37
CAP-RES  (via drill 0.35)
  Top 0.254: U4.24 5.69,14.75 5.69,15.68 5.82,15.8 5.82,16.47 6.4,17.71 9.96,17.71 12.23,14.78 14.14,14.73 15.86,14.74 R4.P$1 16.62,14.87 15.82,15.25 15.05,15.28 v14.53,15.47 | v16.51,27.34 16.51,23.75 U1.6
  Bottom 0.254: v14.53,15.47 14.51,20.63 15.04,22.66 15.04,25.96 v16.51,27.34
DFU  (via drill 0.35)
  Top 0.254: U1.34 14.37,32.81 v14.37,29.57
  Bottom 0.254: v14.37,29.57 13.17,30.77 DFU.P$1
DTR  (via drill 0.35)
  Top 0.254: v12.38,25.5 12.38,22.13 11.87,22.13 11.1,21.37 10.99,19.81 12.19,17.36 C11.P$1
  Bottom 0.254: v12.38,25.5 15.5,28.63 15.5,30.7 15.84,31.14 18.14,31.14 21.5,33.9 21.5,35.1 22,36 24.72,37.9 J1.5
EN  (via drill 0.35)
  Top 0.254: U2.3 20.23,42.82 20.78,42.27 23.03,42.27 | 23.03,42.27 R10.P$2 | 23.03,42.27 v24.2,41.1
  Bottom 0.254: v24.2,41.1 35.3,41.1 EN.1
FRST  (via drill 0.35)
  Top 0.254: U1.38 11.51,34.42 10.87,35.06 v6.89,35.06
  Bottom 0.254: v6.89,35.06 4.76,35.06 FRST.P$1
GND  (via drill 0.35)
  Top 0.254: U4.THERM 5.71,13.98 U4.1 4.96,15.98 4.95,15.98 4.95,16.16 5.16,16.36 5.16,16.77 5.87,17.48 5.88,17.51 5.88,17.89 6.27,18.44 9.09,18.44 10.17,19.52 | C5.P$2 14.75,11.77 17.48,11.77 18.18,10.91 | 18.18,10.91 R4.P$2 17.22,14.72 17.22,16.62 16.62,16.61 C3.P$2 16.09,17.49 14.66,18.06 v12.29,18.77 | v10.42,21.41 10.17,21.23 C1.P$2 10.17,19.52 | v11.13,26.52 11.13,26.03 11.08,25.98 11.08,25.97 11.08,25.82 11.08,25.61 11.13,24.07 U1.1 10.44,23.38 10.44,22.8 10.36,22.62 6.51,22.52 6.13,22.7 6.13,33.7 6.51,33.88 10.36,33.88 | 18.18,10.91 R5.P$2 16.55,7.73 v16.46,7.73 | SW.P$1 19.89,11.64 19.89,9.09 19.23,8.43 I2C.1 | T2.P$2 32.81,5.8 33.22,6.2 | 33.22,6.2 33.72,6.71 34.41,6.71 C2.P$2 36.78,9.08 v36.78,10.52 | R7.P$1 29.25,2.3 v28.4,3.15 | v32.21,6.2 33.22,6.2 | U1.24 22.21,34.3 v22.3,34.4 | U1.12 22.81,23.5 v22.81,23.22 | U3.5 U3.4 34.75,11.45 v34.75,10.52 | EN.2 33.42,43.84 C9.P$2 | RESW.B' RESW.B 8.4,37.13 8.13,37.13 6.3,35.3 6.3,34.82 6.64,34.48 9.77,34.48 10.36,33.88 | 10.36,33.88 10.44,33.8 10.44,33.22 U1.39 | BTL.CATHODE 11.15,1 13.73,1 14.75,1.25 STAT.CATHODE | 10.17,19.52 9.73,19.96 v9.3,19.96
  Bottom 0.254: v10.42,21.41 10.37,22.2 10.82,22.64 10.82,25.2 10.87,25.25 10.87,26.27 v11.13,26.52 | 9.6,19.16 v12.29,18.77 | 9.6,19.16 | v16.46,7.73 19.23,5.47 I2C.1 | v28.4,3.15 30.82,5.57 31.16,5.57 31.79,6.2 v32.21,6.2 | v22.3,34.4 23.57,35.66 B-.1 | v22.81,23.22 22.81,22.46 24.34,20.93 24.34,13.31 22.8,12.77 20.78,10.77 | v36.78,10.52 v34.75,10.52 | v9.3,19.96 9.6,19.66 9.6,19.16
  pour Top: 14,46 44,46 arc-90 46,44 46,2 arc-90 44,0 14,0
  pour Bottom: 14,46 44,46 arc-90 46,44 46,2 arc-90 44,0 14,0
IMU-INT  (via drill 0.35)
  Top 0.254: U1.20 20.93,29.7 v20.48,30.15 | v36.02,15.6 36.06,15.55 U3.8
  Bottom 0.254: v20.48,30.15 20.48,29.88 34.75,15.6 v36.02,15.6
IO-2  (via drill 0.35)
  Top 0.254: v32.31,25.3 32.42,25.2 GPIO.1 42.37,39.63 IO-2.B2,8 | v26.19,26.24 26.15,26.2 U1.15
  Bottom 0.254: v32.31,25.3 27.13,25.3 v26.19,26.24
IO-3  (via drill 0.35)
  Top 0.254: GPIO.2 39.34,24.34 v35.21,24.34 | v25.25,27.61 23.93,27.61 23.19,26.88 22.23,26.88 U1.16
  Bottom 0.254: v35.21,24.34 31.93,27.61 v25.25,27.61 | GPIO.2 42.68,22.66 43.89,21.44 43.89,8.89 IO-3.B2,8
LED_B  (via drill 0.35)
  Top 0.254: U1.25 20.76,31.45 18.95,30.51 v19,30.41 | v27.38,21.7 28.49,20.59 R14.P$2
  Bottom 0.254: v19,30.41 25.94,22.59 27.13,21.95 v27.38,21.7
LED_G  (via drill 0.35)
  Top 0.254: U1.29 18.01,32.69 18.01,31.99 17.61,30.58 v17.61,30.46 | v27.13,17.38 28.12,16.39 R13.P$2
  Bottom 0.254: v17.61,30.46 27.13,19.79 v27.13,17.38
LED_R  (via drill 0.35)
  Top 0.254: U1.30 17.05,32.69 17.05,31.99 16.08,31.02 v16.08,30.46 | v23.45,17.25 23.45,15.22 R12.P$2
  Bottom 0.254: v16.08,30.46 20.78,25.76 20.78,23.22 23.32,20.68 23.32,17.38 v23.45,17.25
N$1
  Top 0.254: L1.P$2 17.76,20.33 19.38,21.95 19.38,23.68 U1.10
N$2
  Top 0.254: C1.P$1 14.3,20.32 L1.P$1 15.76,22.23 18.19,22.23 18.66,22.24 U1.9
N$3  (via drill 0.35)
  Top 0.254: R5.P$1 16.49,10.45 v15.7,11.03 | v11.56,11.05 9.86,11.99 U4.14
  Bottom 0.254: v15.7,11.03 12.14,11 v11.56,11.05
N$4
  Top 0.254: BUZZER.BZ- 38.97,12.09 38.97,9.96 38.26,9.25 38.24,9.25 35.72,6.73 35.72,6.28 35.36,5.93 35.36,3.83 35.22,3.68 35.06,3.68 T2.P$3 32.24,2.38 31.16,1.3 30.34,1.3 30.2,1.45 30.2,2.55 30.75,3.11 R8.P$2
N$5
  Top 0.254: C6.P$1 U5.P$1
N$7  (via drill 0.35)
  Top 0.254: v39.32,18.32 U5.P$9
  Bottom 0.254: M-.1 39.32,32.51 v39.32,18.32
N$8  (via drill 0.35)
  Top 0.254: v38.2,17.28 36.54,17.28 U5.P$7
  Bottom 0.254: M+.1 37.67,34.43 38.2,33.9 38.17,17.31 v38.2,17.28
N$9
  Top 0.254: R6.P$2 16.05,2.4 STAT.ANODE
N$11
  Top 0.254: C4.P$1 26.99,29.94 X1.P$1 29.67,27.26 29.67,22.71 25.78,22.71 25.24,23.25 25.24,23.45 23.95,24.74 22.27,24.74 U1.13
N$12
  Top 0.254: 28.4,27.03 28.17,26.8 X1.P$2 27.73,24.47 C8.P$1 24.1,25.51 U1.14
N$13
  Top 0.254: D1.C 12.54,44.19 13.16,44.81 15.12,44.81 Q1.2 16.64,44.48 16.97,44.81 22.05,44.81 22.05,43.72 U2.1 22.15,43.64 23.32,44.81 25.1,44.81 26.62,43.29 26.62,42.27 R10.P$1 26.6,44.41 27,44.81 28.47,44.81 C10.P$1
N$14
  Top 0.254: D3.P$2 21.64,15.53 R12.P$1
N$16
  Top 0.254: D3.P$3 24.74,18.28 R13.P$1
N$17
  Top 0.254: D3.P$4 27.88,20.43 R14.P$1
N$18
  Top 0.254: R15.P$2 12.69,5.33 BTL.ANODE
N$20  (via drill 0.35)
  Top 0.254: C11.P$2 14.1,17.44 14.1,16.29 11.76,16.27 11.42,16.7 11.29,16.82 11.24,17.44 v10.6,18.09
  Bottom 0.254: v10.6,18.09 10.7,17.5 8.02,17.47 6.3,17.42 SJ1.2
RESET  (via drill 0.35)
  Top 0.254: RESW.A' 18.99,35.87 19.34,35.51 23.79,35.51 R11.P$1 25.35,33.95 25.35,32.97 25.83,32.49 32.16,32.49 32.66,32.99 D2.ANODE | RESW.A' 13.82,34.94 13.82,34.65 | U1.35 13.82,32.96 13.82,34.65 | v14.66,34.15 14.16,34.65 13.82,34.65 | RESW.A 9.64,35.87 10.63,36.86 11.12,36.86 12.11,35.87 RESW.A'
  Bottom 0.254: SJ1.1 5.12,19.97 5.26,19.79 5.39,19.77 RST.P$1 9.84,22.72 10.36,22.72 10.44,22.8 10.44,29.93 10.44,30.08 12.65,32.29 12.8,32.29 v14.66,34.15
RXD  (via drill 0.35)
  Top 0.254: U1.21 v24.63,30.4 v24.64,30.41
  Bottom 0.254: v24.64,30.41 30.24,36.01 J1.7
SCL  (via drill 0.35)
  Top 0.254: U5.P$2 32.01,18.22 30.61,18.22 30.2,17.82 30.2,14.79 31.86,13.12 U3.14 31.86,12.74 31.56,12.44 31.56,11.03 33.16,9.43 R1.P$2 32.48,8.56 29.59,8.56 26.84,5.82 I2C.4 | U1.3 14.43,23.73 v14.38,26.55 | v4.35,10.03 4.35,11.23 4.3,11.28 4.3,12.19 4.49,12.38 4.85,12.38 U4.4
  Bottom 0.254: v14.38,26.55 13.61,25.78 13.1,25.66 13.1,18.45 13.15,16.95 10.7,16.95 8.84,15.09 8.84,13.87 8.92,13.8 3.1,13.75 3.1,11.73 4.35,11.76 v4.35,10.03 6.44,9.73 6.55,9.84 10.07,9.84 10.25,6.76 10.25,1.51 11.71,1.26 22.99,1.26 I2C.4
SDA  (via drill 0.35)
  Top 0.254: U5.P$3 30.74,17.82 30.58,17.66 30.58,15.61 30.77,15.43 | 30.77,15.43 U3.13 | 30.77,15.43 30.94,15.6 v32.21,15.6 | v29.98,11.36 29.98,9.72 R2.P$2 28.4,9.25 24.3,5.16 I2C.3 | U1.2 13.76,25.16 v13.72,25.2 | v3.94,12.98 U4.3
  Bottom 0.254: v32.21,15.6 29.98,13.37 v29.98,11.36 | 13.64,25.2 v13.72,25.2 13.72,18.11 13.74,18.09 13.82,16.22 11.41,16.18 10.04,15.19 10.04,13.03 v3.94,12.98 8.04,13.01 8.04,12.59 10.62,10.01 11.37,6.79 11.37,2.13 11.33,2.12 22.66,2.07 I2C.3
STATLED  (via drill 0.35)
  Top 0.254: R6.P$1 18.55,8.49 19.48,9.25 | 19.48,9.25 19.51,9.25 | v17.3,25.99 17.26,25.95 U1.7 | v19.59,19.18 19.59,11.88 19.51,11.8 19.51,9.28 19.48,9.25
  Bottom 0.254: v19.59,19.18 19.54,19.11 19.51,25.76 17.53,25.76 v17.3,25.99
SWCLK  (via drill 0.35)
  Top 0.254: U1.36 13.06,34.55 v13.16,34.65
  Bottom 0.254: v13.16,34.65 13.16,35.92 11.89,37.19 9.84,37.19 7.13,34.48 6.64,34.48 | 6.64,34.48 | 6.15,34.29 5.99,34.29 | 5.99,34.29 5.64,34.28 3.09,34.26 3.1,32.11 3.1,28.3 3.97,28.3 SWCLK.P$1 | 5.99,34.29 6.46,34.29 6.64,34.48
SWDIO  (via drill 0.35)
  Top 0.254: U1.37 12.27,32.99 12.2,34.88 10.87,36.2 v10.87,36.28
  Bottom 0.254: SWDIO.P$1 6.43,32.74 6.43,33.8 9.03,33.79 v10.87,36.28
SWO  (via drill 0.35)
  Top 0.254: U1.32 15.8,32.96 v15.8,34.9
  Bottom 0.254: v15.8,34.9 14.71,34.9 12.05,37.57 7.92,37.57 6.98,36.73 3.15,36.73 2.67,36.75 2.62,33.18 2.62,32.27 2.62,26.15 SWO.P$1
TXD  (via drill 0.35)
  Top 0.254: U1.19 24.02,29 v24.06,28.96
  Bottom 0.254: v24.06,28.96 24.06,30.65 24.4,30.99 24.46,30.99 27.7,34.23 J1.6
VBAT  (via drill 0.35)
  Top 0.406: v13.26,41.69 13.91,42.33 Q1.3
  Bottom 0.406: 13.26,42.17 15,40.43 J1.1 15,36.62 15.7,35.92 18.13,35.92 B+.1 | 13.16,42.27 13.26,42.17 | 13.26,42.17 v13.26,41.69
VBUS  (via drill 0.35)
  Top 0.406: D1.A 15.75,40.49 Q1.1 17.86,41.38 19.51,39.73 20.89,39.73 J1.4 | v33.48,39.27 33.95,39.26 R9.P$1
  Bottom 0.406: J1.4 24.35,39.27 v33.48,39.27

### Text on the board
tPlace: <- | DOCK | <- | VBAT | 3.3v | GND | VBU | DTR | TXD | RXD | T-A | IO-2 | /Users/Simone/Desktop/noun_143916_cc.bmp | GND | HAPTIC | MOTOR | IO2 | T-A | IO3 | T-B | 3.3v | GND | T-B | IO-3 | GND | 3.3v | SDA | SCL
bPlace: VBAT | 3.3v | GND | VBU | DTR | TXD | RXD | Tiles IoT Toolkit | P#3 RevB (2017) | simone.mora@ntnu.no | IO2 | T-A | IO3 | T-B | 3.3v | BATTERY | GND | GND | 3.3v | SDA | SCL | http://tilestoolkit.io